# Altium schematic sheet V3Lights.SchDoc
size A
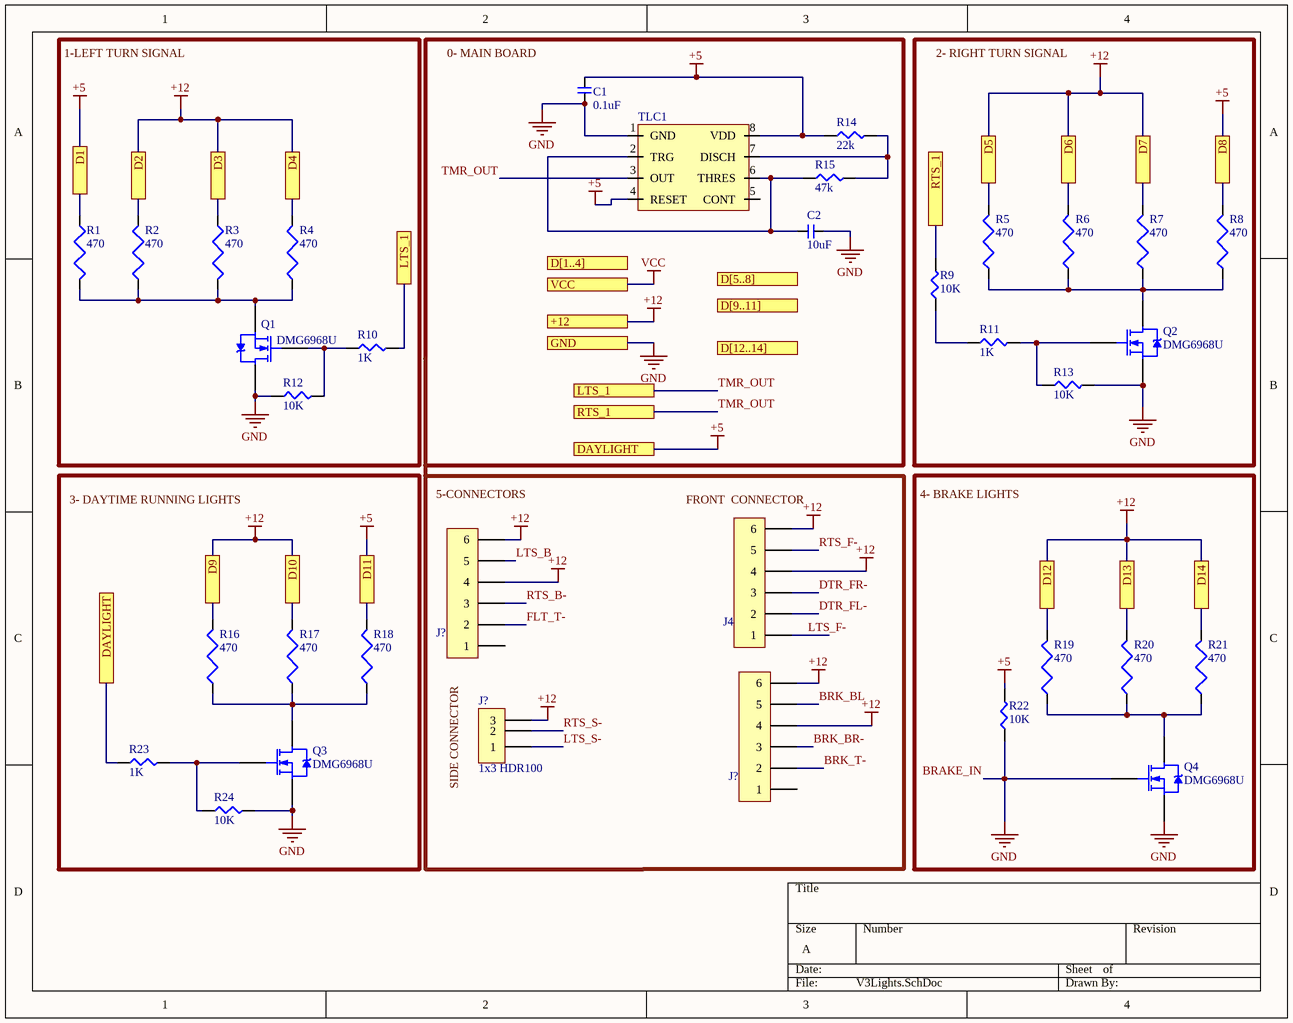
[diagram p0: V3Lights.SchDoc]

## Parts
(Parts that share a designator on the sheet are numbered #1, #2 ... from top to bottom, then left to right.)
C1  0.1uF  [C0805]
C2  10uF  [C0805]
J4  2x3 Socket, RA  [MOLEX 105314 6 CON]  (value not drawn)
J?#1  2x3 Socket, RA  [MOLEX 105314 6 CON]  (value not drawn)
J?#2  1x3 HDR100  [MOLEX 0901200763]
J?#3  2x3 Socket, RA  [MOLEX 105314 6 CON]  (value not drawn)
Q1  DMG6968U  [MOSFET DMG6968UDICT-ND]
Q2  DMG6968U  [MOSFET DMG6968UDICT-ND]
Q3  DMG6968U  [MOSFET DMG6968UDICT-ND]
Q4  DMG6968U  [MOSFET DMG6968UDICT-ND]
R1  470  [R0805]
R2  470  [R0805]
R3  470  [R0805]
R4  470  [R0805]
R5  470  [R0805]
R6  470  [R0805]
R7  470  [R0805]
R8  470  [R0805]
R9  10K  [R0805]
R10  1K  [R0805]
R11  1K  [R0805]
R12  10K  [R0805]
R13  10K  [R0805]
R14  22k  [R0805]
R15  47k  [R0805]
R16  470  [R0805]
R17  470  [R0805]
R18  470  [R0805]
R19  470  [R0805]
R20  470  [R0805]
R21  470  [R0805]
R22  10K  [R0805]
R23  1K  [R0805]
R24  10K  [R0805]
TLC1  TLC555IP_TIMER  [TLC555IP]  (value not drawn)

## Blocks framed on the sheet
1-LEFT TURN SIGNAL: Q1 R1-R4 R10 R12
0- MAIN BOARD: C1 C2 R14 R15 TLC1
2- RIGHT TURN SIGNAL: Q2 R5-R9 R11 R13
3- DAYTIME RUNNING LIGHTS: Q3 R16-R18 R23 R24
4- BRAKE LIGHTS: Q4 R19-R22

## Ports
+12, D1, D2, D3, D4, D5, D6, D7, D8, D9, D10, D11, D12, D13, D14, D[1..4], D[5..8], D[9..11], D[12..14], DAYLIGHT, GND, LTS_1, RTS_1, VCC

## Nets
+5: C1.2 R1.1 R8.2 R14.1 R18.2 R22.2 R23.1 TLC1.4(RESET) TLC1.8(VDD) ; port DAYLIGHT, port D11, port D1, port D8
+12: J4.4 J4.6 J?#1.4 J?#1.6 J?#2.3 J?#3.4 J?#3.6 R2.2 R3.1 R4.2 R5.2 R6.2 R7.2 R16.2 R17.2 R19.2 R20.2 R21.2 ; port +12, port D9, port D10, port D2, port D3, port D4, port D5, port D6, port D7, port D12, port D13, port D14
BRAKE_IN: C1.1 C2.2 Q1.2(D) Q2.3(S) Q3.3(S) Q4.1(G) Q4.3(S) R12.1 R13.2 R22.1 R24.2 TLC1.1(GND) ; port GND  [also labelled GND]
VCC: port VCC
BRK_BL: J?#3.5
BRK_BR-: J?#3.3
BRK_T-: J?#3.2
DTR_FL-: J4.2
DTR_FR-: J4.3
FLT_T-: J?#1.2
LTS_B: J?#1.5
LTS_F-: J4.1
LTS_S-: J?#2.1
RTS_B-: J?#1.3
RTS_F-: J4.5
RTS_S-: J?#2.2
TMR_OUT: R9.2 R10.2 TLC1.3(OUT) ; port LTS_1, port RTS_1
NetC2_1: C2.1 R15.1 TLC1.2(TRG) TLC1.6(THRES)
NetQ1_1: Q1.1(G) R10.1 R12.2
NetQ1_3: Q1.3(S) R1.2 R2.1 R3.2 R4.1
NetQ2_1: Q2.1(G) R11.2 R13.1
NetQ2_2: Q2.2(D) R5.1 R6.1 R7.1 R8.1
NetQ3_1: Q3.1(G) R23.2 R24.1
NetQ3_2: Q3.2(D) R16.1 R17.1 R18.1
NetQ4_2: Q4.2(D) R19.1 R20.1 R21.1
NetR9_1: R9.1 R11.1
NetR14_2: R14.2 R15.2 TLC1.7(DISCH)

Not connected (* = marked no-connect by the designer): J?#1 1; J?#3 1; TLC1 5(CONT)

## Notes on the sheet
- (near J?#1) 5-CONNECTORS
- (near J4) FRONT  CONNECTOR
- (near J?#2) SIDE CONNECTOR

## Library data of the parts
C1 = CL21B104KBCWPNC: CAP CER 0.1UF 50V X7R 0805; Manufacturer: Samsung; Capacitance: 100nF; Tolerance: 10%; Supplier 1: Digi-Key; Supplier Part Number 1: 1276-6557-1-ND; Manufacturer Part Number: CL21B104KBCWPNC; Stock 1: 6545; Pricing 1: 1 = 0.10000, 10 = 0.06700, 100 = 0.02990, 500 = 0.02138, 1000 = 0.01680 (USD); RoHS: Yes; Mount: Surface Mount; Case/Package: 0805; Case Code (Metric): 2012; Case Code (Imperial): 0805; Min Operating Temperature: -55°C; Max Operating Temperature: 125°C; Packaging: Tape and Reel; Voltage Rating: 50V; Features: Soft Termination; Length: 0.079inch; Width: 0.049inch; Thickness: 0.053inch; Ratings: AEC-Q200; Category: Capacitors
C2 = C0805C106K8PACTU: CAP CER 10UF 10V X5R 0805; Manufacturer: Samsung; Manufacturer Part Number: CL21B105KAFNNNE; Capacitance: 1uF; Tolerance: 10%; Voltage Rating: 25V; Dielectric: X7R; RoHS: Yes; Mount: Surface Mount; Case/Package: 0805; Contact Plating: Tin; Case Code (Metric): 2012; Case Code (Imperial): 0805; Min Operating Temperature: -55°C; Max Operating Temperature: 125°C; Packaging: Tape and Reel; Package Quantity: 1; Voltage: 25V; Voltage Rating (DC): 25V; Length: 2mm; Height: 1.25mm; Depth: 1.25mm; Width: 0.049inch; Thickness: 0.053inch; Radiation Hardening: No; Lead Free: Lead Free; Category: Capacitors; ComponentLink1Description: https://www.digikey.ca/product-detail/en/kemet/C0805C106K8PACTU/399-4925-1-ND/1090920; ComponentLink1URL: https://www.digikey.ca/product-detail/en/kemet/C0805C106K8PACTU/399-4925-1-ND/1090920; Supplier 1: Digi-Key; Supplier Part Number 1: 399-4925-1-ND
J4 J?#1 J?#3 = 1053141206: CONN HEADER R/A 6POS 2.5MM; Manufacturer: Molex; Gender: Male; Supplier 1: Digi-Key; Supplier Part Number 1: WM14977-ND; Manufacturer Part Number: 1053141206; Stock 1: 3725; Pricing 1: 1 = 1.86000, 10 = 1.68400, 204 = 1.44314, 612 = 1.20260, 1020 = 1.03080, 5100 = 0.91398, 10200 = 0.89336 (USD); RoHS: No; Mount: Through Hole; Contact Plating: Gold; Contact Material: Brass; Color: Black; Termination: Through Hole; Number of Rows: 2; REACH SVHC: Unknown; ComponentLink1URL: http://www.farnell.com/datasheets/2221464.pdf?src-supplier=Farnell; ComponentLink1Description: http://www.farnell.com/datasheets/2221464.pdf?src-supplier=Farnell; ComponentLink2URL: http://www.farnell.com/datasheets/2059602.pdf?src-supplier=Element14; ComponentLink2Description: http://www.farnell.com/datasheets/2059602.pdf?src-supplier=Element14; ComponentLink3URL: https://www.molex.com/pdm_docs/ps/PS-105300-100-001.pdf?src-supplier=Digi-Key; ComponentLink3Description: https://www.molex.com/pdm_docs/ps/PS-105300-100-001.pdf?src-supplier=Digi-Key; Category: Connectors
J?#2 = 0901200763: CONN HEADER VERT 3POS 2.54MM; Manufacturer: Molex; Manufacturer Part Number: 90120-0763; Number of Positions: 3; Gender: Male; Contact Resistance: 20mR; Max Voltage Rating (DC): 350.35kV; Current Rating: 3A; Voltage Rating (AC): 350V; Insulation Resistance: 5GR; Number of Circuits: 2; Glow Wire Compliant: Non-compliant; Supplier 1: Digi-Key; Supplier Part Number 1: WM8085-ND; Stock 1: 17038; Pricing 1: 1 = 0.90000, 10 = 0.79100, 100 = 0.68200, 500 = 0.55800, 1000 = 0.49600, 5000 = 0.43400, 10000 = 0.41230 (USD); RoHS: Yes; Mount: Through Hole; Color: Black; Housing Color: Black; Housing Material: Polyester; Contact Plating: Tin; Contact Material: Brass; Material: Glass; Min Operating Temperature: -55°C; Max Operating Temperature: 125°C; Number of Rows: 1; Packaging: Tray; Termination: Solder; Orientation: Straight; Number of Contacts: 3; Package Quantity: 3000; Number of Poles: 3; Voltage Rating: 350V; Working Voltage: 350V; Voltage Rating (DC): 350V; Pitch: 2.54mm; Lead Pitch: 2.54mm; Radiation Hardening: No; REACH SVHC: Unknown; Lead Free: Lead Free; Flammability Rating: UL94 V-2; Halogen Free: Not Halogen Free; ComponentLink1URL: https://datasheet.ciiva.com/30177/19330901200763-pcb-headers-30177538.pdf?src-supplier=Onlinecomponents.com; ComponentLink1Description: https://datasheet.ciiva.com/30177/19330901200763-pcb-headers-30177538.pdf?src-supplier=Onlinecomponents.com; ComponentLink2URL: https://datasheet.ciiva.com/11747/0900766b8002f268-11747896.pdf?src-supplier=RSComponents; ComponentLink2Description: https://datasheet.ciiva.com/11747/0900766b8002f268-11747896.pdf?src-supplier=RSComponents; ComponentLink3URL: https://datasheet.ciiva.com/5150/0901200763-pcb-headers-230143-5150559.pdf?src-supplier=Mouser; ComponentLink3Description: https://datasheet.ciiva.com/5150/0901200763-pcb-headers-230143-5150559.pdf?src-supplier=Mouser; Category: Connectors
Q1-Q4 = DMG6968U-7: MOSFET N-CH 20V 6.5A SOT-23; Manufacturer: Diodes; Nominal Vgs: 500mV; Input Capacitance: 151pF; Max Power Dissipation: 1.3W; Number of Elements: 1; Rise Time: 66ns; Rds On Max: 25mR; Turn-Off Delay Time: 613ns; Turn-On Delay Time: 54ns; Fall Time: 205ns; Element Configuration: Single; Gate to Source Voltage (Vgs): 12V; On-State Resistance: 36mR; Supplier 1: Digi-Key; Supplier Part Number 1: DMG6968UDICT-ND; Manufacturer Part Number: DMG6968U-7; Stock 1: 169109; Pricing 1: 1 = 0.59000, 10 = 0.41800, 100 = 0.27420, 500 = 0.16202, 1000 = 0.12463 (USD); RoHS: Yes; Mount: Surface Mount; Case/Package: SOT-23; Number of Pins: 3; Weight: 0.000282oz; Min Operating Temperature: -55°C; Max Operating Temperature: 150°C; Packaging: Tape and Reel; Package Quantity: 3000; Drain to Source Voltage (Vdss): 20V; Continuous Drain Current (ID): 6.5A; Drain to Source Breakdown Voltage: 20V; Drain to Source Resistance: 25mR; Power Dissipation: 1.3W; Threshold Voltage: 500mV; Number of Channels: 1; Length: 2.9mm; Height: 1mm; Width: 1.3mm; Radiation Hardening: No; REACH SVHC: No SVHC; Lead Free: Lead Free; ComponentLink1URL: https://datasheet.ciiva.com/5774/ds31738-5774992.pdf?src-supplier=Farnell; ComponentLink1Description: https://datasheet.ciiva.com/5774/ds31738-5774992.pdf?src-supplier=Farnell; ComponentLink2URL: https://datasheet.ciiva.com/26789/dmg6968u-7-26789941.pdf?src-supplier=IIIC; ComponentLink2Description: https://datasheet.ciiva.com/26789/dmg6968u-7-26789941.pdf?src-supplier=IIIC; ComponentLink3URL: https://datasheet.ciiva.com/935/ds31738-935016.pdf?src-supplier=Digi-Key; ComponentLink3Description: https://datasheet.ciiva.com/935/ds31738-935016.pdf?src-supplier=Digi-Key; ComponentLink4URL: https://datasheet.ciiva.com/935/ds31738-935018.pdf?src-supplier=Digi-Key; ComponentLink4Description: https://datasheet.ciiva.com/935/ds31738-935018.pdf?src-supplier=Digi-Key; ComponentLink5URL: https://datasheet.ciiva.com/935/ds31738-935017.pdf?src-supplier=Digi-Key; ComponentLink5Description: https://datasheet.ciiva.com/935/ds31738-935017.pdf?src-supplier=Digi-Key; ComponentLink6URL: https://datasheet.ciiva.com/22712/1915638-22712395.pdf?src-supplier=Element14; ComponentLink6Description: https://datasheet.ciiva.com/22712/1915638-22712395.pdf?src-supplier=Element14; Category: Discrete Semiconductor Products
R1-R8 R16-R21 = ERJ6ENF470V
R9 R12 R13 R22 R24 = ERJ6ENF1002V: RES SMD 10K OHM 1% 1/8W 0805; Manufacturer: Yageo; Manufacturer Part Number: ERJ-6ENF1002V; Temperature Coefficient: 100ppm/°C; Voltage Rating (DC): 150V; Power Rating: 125mW; Resistance: 10000R; Supplier 1: Digi-Key; Supplier Part Number 1: P10.0KCCT-ND; Stock 1: 3342401; Pricing 1: 1 = 0.100000, 10 = 0.081000, 100 = 0.031100, 1000 = 0.013670, 2500 = 0.011810 (USD); RoHS: No; Mount: Surface Mount; Case/Package: 0805; Number of Pins: 2; Min Operating Temperature: -55°C; Max Operating Temperature: 155°C; Packaging: Tape and Reel; Tolerance: 1%; Length: 2mm; Height: 0.5mm; Depth: 1.25mm; Width: 1.25mm; REACH SVHC: No SVHC; Lead Free: Lead Free; ComponentLink1URL: https://datasheet.ciiva.com/27056/2078477-27056611.pdf?src-supplier=Jameco; ComponentLink1Description: https://datasheet.ciiva.com/27056/2078477-27056611.pdf?src-supplier=Jameco; Category: Resistors
R10 R11 R23 = ERJ6ENF1001V: RES SMD 1K OHM 1% 1/8W 0805; Manufacturer: Panasonic; Resistance: 1kR; Power Rating: 125mW; Temperature Coefficient: 100ppm/°C; Voltage Rating (DC): 150V; Supplier 1: Digi-Key; Supplier Part Number 1: P1.00KCCT-ND; Manufacturer Part Number: ERJ6ENF1001V; Stock 1: 946321; Pricing 1: 1 = 0.100000, 10 = 0.081000, 100 = 0.031100, 1000 = 0.013670, 2500 = 0.011810 (USD); RoHS: Yes; Mount: Surface Mount; Case/Package: 0805; Number of Pins: 2; Case Code (Metric): 2012; Case Code (Imperial): 0805; Contact Plating: Tin; Min Operating Temperature: -55°C; Max Operating Temperature: 155°C; Tolerance: 1%; Packaging: Tape and Reel; Number of Terminations: 2; Package Quantity: 1; Voltage Rating: 150V; Composition: Thick Film; Termination: SMD/SMT; Military Standard: Not; Max Power Dissipation: 125mW; Features: Automotive AEC-Q200; Length: 2mm; Height: 0.6mm; Width: 0.049inch; Depth: 1.25mm; Radiation Hardening: No; REACH SVHC: No SVHC; Lead Free: Lead Free; ComponentLink1URL: https://datasheet.ciiva.com/34303/1988962-34303619.pdf?src-supplier=Jameco; ComponentLink1Description: https://datasheet.ciiva.com/34303/1988962-34303619.pdf?src-supplier=Jameco; ComponentLink2URL: https://datasheet.ciiva.com/11808/0900766b80f80784-11808500.pdf?src-supplier=RSComponents; ComponentLink2Description: https://datasheet.ciiva.com/11808/0900766b80f80784-11808500.pdf?src-supplier=RSComponents; ComponentLink3URL: https://datasheet.ciiva.com/28532/426256-28532134.pdf?src-supplier=Element14; ComponentLink3Description: https://datasheet.ciiva.com/28532/426256-28532134.pdf?src-supplier=Element14; ComponentLink4URL: https://datasheet.ciiva.com/30051/aoa0000ce2-30051974.pdf?src-supplier=Onlinecomponents.com; ComponentLink4Description: https://datasheet.ciiva.com/30051/aoa0000ce2-30051974.pdf?src-supplier=Onlinecomponents.com; ComponentLink5URL: https://datasheet.ciiva.com/16774/70260748-16774249.pdf?src-supplier=Allied+Electronics; ComponentLink5Description: https://datasheet.ciiva.com/16774/70260748-16774249.pdf?src-supplier=Allied+Electronics; ComponentLink6URL: https://datasheet.ciiva.com/46373/1678782-46373337.pdf?src-supplier=Element14; ComponentLink6Description: https://datasheet.ciiva.com/46373/1678782-46373337.pdf?src-supplier=Element14; ComponentLink7URL: https://datasheet.ciiva.com/46373/1678782-46373338.pdf?src-supplier=Element14; ComponentLink7Description: https://datasheet.ciiva.com/46373/1678782-46373338.pdf?src-supplier=Element14; ComponentLink8URL: https://datasheet.ciiva.com/48532/aoa0000ce2-48532156.pdf?src-supplier=Avnet; ComponentLink8Description: https://datasheet.ciiva.com/48532/aoa0000ce2-48532156.pdf?src-supplier=Avnet; ComponentLink9URL: https://datasheet.ciiva.com/7942/426256-7942429.pdf?src-supplier=Element14; ComponentLink9Description: https://datasheet.ciiva.com/7942/426256-7942429.pdf?src-supplier=Element14; ComponentLink10URL: https://datasheet.ciiva.com/16199/aoa0000ce2-16199262.pdf?src-supplier=Future+Electronics; ComponentLink10Description: https://datasheet.ciiva.com/16199/aoa0000ce2-16199262.pdf?src-supplier=Future+Electronics; ComponentLink11URL: https://datasheet.ciiva.com/9117/aoa0000ce2-9117391.pdf?src-supplier=Avnet; ComponentLink11Description: https://datasheet.ciiva.com/9117/aoa0000ce2-9117391.pdf?src-supplier=Avnet; ComponentLink12URL: https://datasheet.ciiva.com/16523/aoa0000ce2-16523855.pdf?src-supplier=Avnet+Asia; ComponentLink12Description: https://datasheet.ciiva.com/16523/aoa0000ce2-16523855.pdf?src-supplier=Avnet+Asia; Category: Resistors
R14 = ERJ6ENF22000V
R15 = ERJ6ENF47000V
TLC1 = TLC555IP_TIMER: Category 1: 555 Timer; Supplier 1: Digi-Key; Supplier Part Number 1: 296-1858-5-ND